# Altium project democritus-robot.PrjPcb
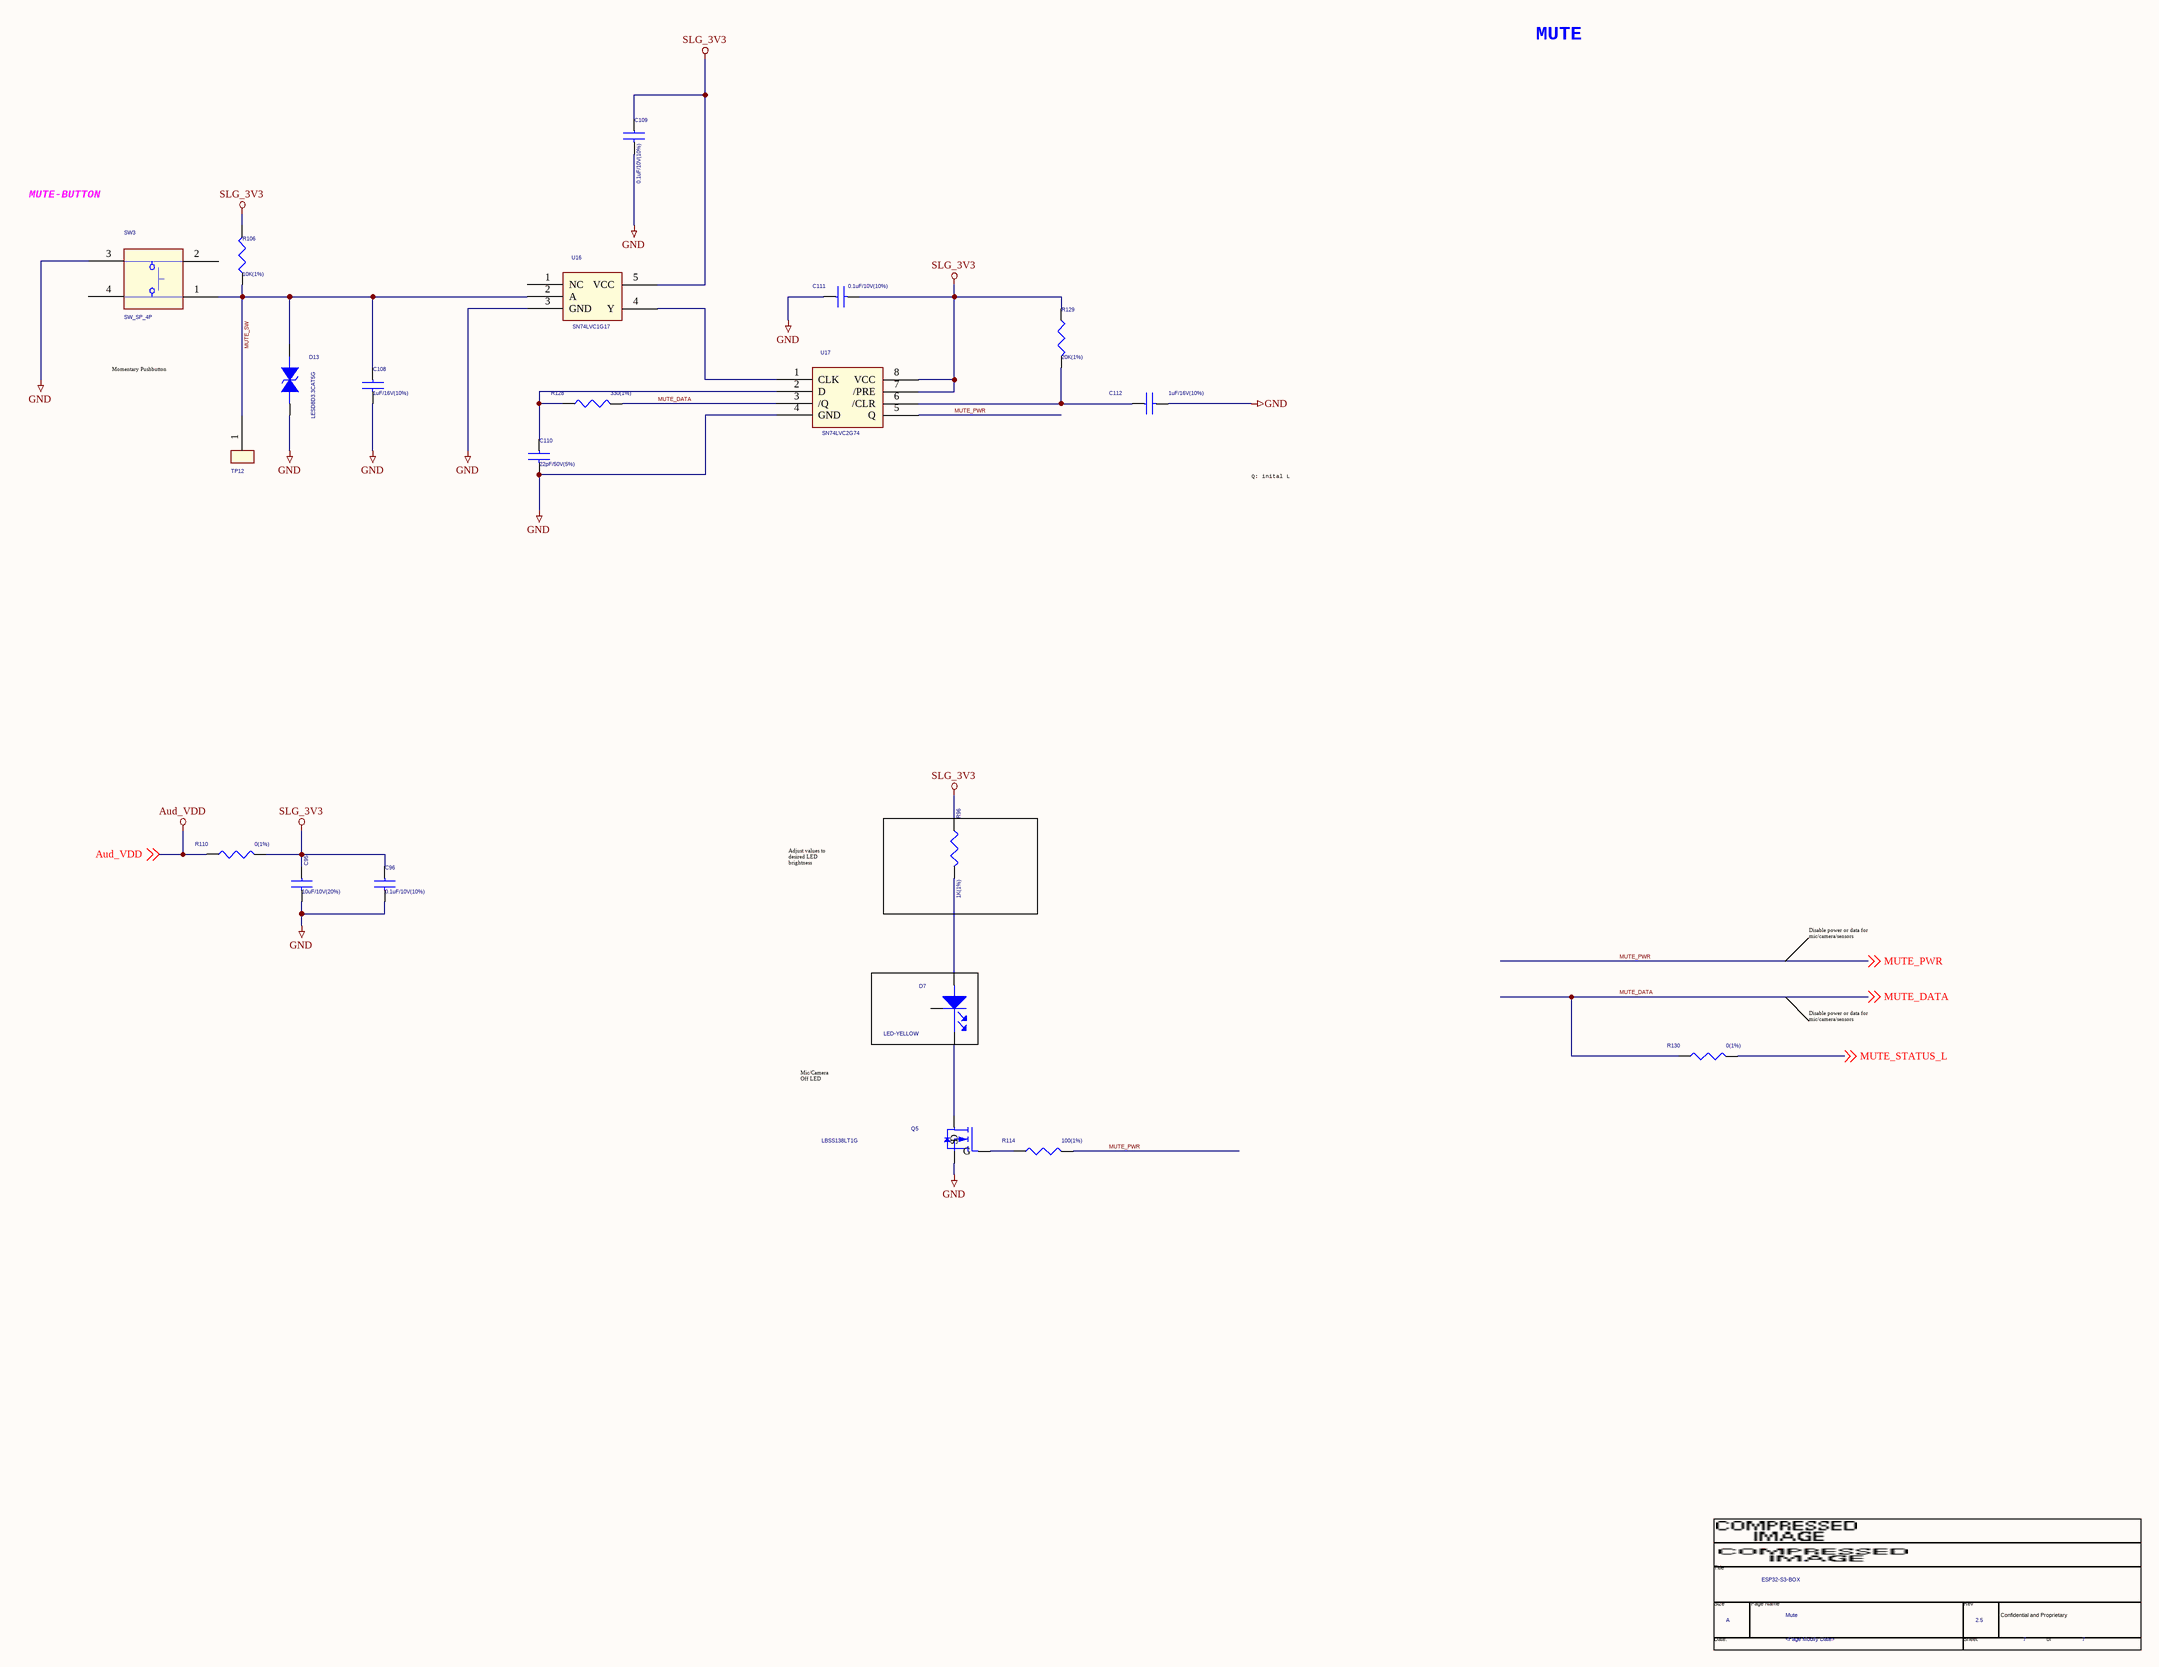
[diagram p0: 07_Mute.SchDoc]
3 sheets, 90 parts. Net scope: global (net labels, ports and power ports of the same name join across sheets).
Sheets:
  07_Mute.SchDoc
  05_Codec.SchDoc
  03_Module.SchDoc

## Sheet 07_Mute.SchDoc
size 513 x 386 mm

### Parts
(Parts that share a designator on the sheet are numbered #1, #2 ... from top to bottom, then left to right.)
*#1  Page Modify Date: <Page Modify Date>  Page Name: Mute  Title: ESP32-S3-BOX  Page Size: A  Page Number: 7  RevCode: 2.5  (hidden comment: espTitleBlock3)  (graphical)
C95  10uF/10V(20%)  [C0402]
C96  0.1uF/10V(10%)  [C0201]
C108  1uF/16V(10%)  [C0402]
C109  0.1uF/10V(10%)  [C0402]
C110  22pF/50V(5%)  [C0402]
C111  0.1uF/10V(10%)  [C0402]
C112  1uF/16V(10%)  [C0402]
D7  LED-YELLOW  [LED_SMD1206]
D13  LESD8D3.3CAT5G  [SOD882]
Q5  LBSS138LT1G  [SOT23-3]
R96  1K(1%)  [R0201]
R106  10K(1%)  [R0201]
R110  0(1%)  [R0402]
R114  100(1%)  [R0201]
R128  330(1%)  [R0402]
R129  20K(1%)  [R0402]
R130  0(1%)  [R0402]
SW3  SW_SP_4P  [SW4-3X3P5X1P1-SMT]
TP12  TESTPOINT  [TPC_D40]  (value not drawn)
U16  SN74LVC1G17  [SOT23-5-S]
U17  SN74LVC2G74  [VSSOP8]

### Nets
Aud_VDD: R110.1 ; off-sheet Aud_VDD
GND: C95.2 C96.2 C108.2 C109.2 C110.2 C111.1 C112.2 D13.1 Q5.2(S) SW3.3 U16.3(GND) U17.4(GND)
SLG_3V3: C95.1 C96.1 C109.1 C111.2 R96.2 R106.2 R110.2 R129.1 U16.5(VCC) U17.7(/PRE) U17.8(VCC)
MUTE_DATA: R128.2 R130.1 U17.3(/Q) ; off-sheet MUTE_DATA
MUTE_PWR: R114.2 U17.5(Q) ; off-sheet MUTE_PWR
MUTE_STATUS_L: R130.2 ; off-sheet MUTE_STATUS_L  [project net GPIO1]
MUTE_SW: C108.1 D13.2 R106.1 SW3.1 TP12.1 U16.2(A)
NetC110_1: C110.1 R128.1 U17.2(D)
NetC112_1: C112.1 R129.2 U17.6(/CLR)
NetD7_1: D7.1 R96.1
NetD7_2: D7.2 Q5.3(D)
NetQ5_1: Q5.1(G) R114.1
NetU16_4: U16.4(Y) U17.1(CLK)

Not connected (* = marked no-connect by the designer): D7 3; SW3 2 4; U16 1(NC)

### Notes on the sheet
- MUTE
- MUTE-BUTTON
- Momentary Pushbutton
- Q: inital L
- Adjust values to
  desired LED
  brightness
- Disable power or data for
  mic/camera/sensors
- Mic/Camera
  Off LED
- (in symbol espTitleBlock3) Title; Size; Page Name; Rev; Confidential and Proprietary; Date:; Sheet; of

### Library data of the parts
*#1 = espTitleBlock3: Doc: ESP32-S3-EYE_V1.0; OrgName: ESPRESSIF; Page Count: 7
C95 = CAPACITOR: Part Number: ES11047103700000; CODE12: ES11.04.710.3.7.0.00; Part Type: Capacitor
C96 = CAPACITOR: Part Number: ES11025103610001; CODE12: ES11.02.510.3.6.1.00; Part Type: Capacitor
C108 C112 = CAPACITOR: Part Number: ES11046104610000; CODE12: ES11.04.610.4.6.1.00; Part Type: Capacitor
C109 C111 = CAPACITOR: Part Number: ES11045103620000; CODE12: ES11.04.510.3.6.2.00; Part Type: Capacitor
C110 = CAPACITOR: Part Number: ES11041226520001; CODE12: ES11.04.122.6.5.2.00; Part Type: Capacitor
D7 = LED-BLUE
D13 = DIODE_BI_DIR: Part Number: ES31320010000000; CODE12: ES31.32.0010.00.0.0; Part Type: Diode
Q5 = NMOS: Part Number: ES31440030000000; CODE12: ES31.44.0030.00.0.0; Part Type: Transistor
R96 = RESISTOR: Part Number: ES21023100000001; CODE12: ES21.02.3100.0.00.0; Part Type: Resistor
R106 = RESISTOR: Part Number: ES21024100000001; CODE12: ES21.02.4100.0.00.0; Part Type: Resistor
R110 R130 = RESISTOR: Part Number: ES21040000000001; CODE12: ES21.04.0000.0.00.0; Part Type: Resistor
R114 = RESISTOR: Part Number: ES21022100000001; CODE12: ES21.02.2100.0.00.0; Part Type: Resistor
R128 = RESISTOR
R129 = RESISTOR: Part Number: ES21044200000001; CODE12: ES21.04.4200.0.00.0; Part Type: Resistor
SW3 = SW_SP_4P: CLASS: DISCRETE; TIME: 2004-11-29
TP12 = TESTPOINT: Part Number: ES51990010000000; CODE12: ES51.99.0010.00.00; Part Type: -

## Sheet 05_Codec.SchDoc
size 513 x 386 mm
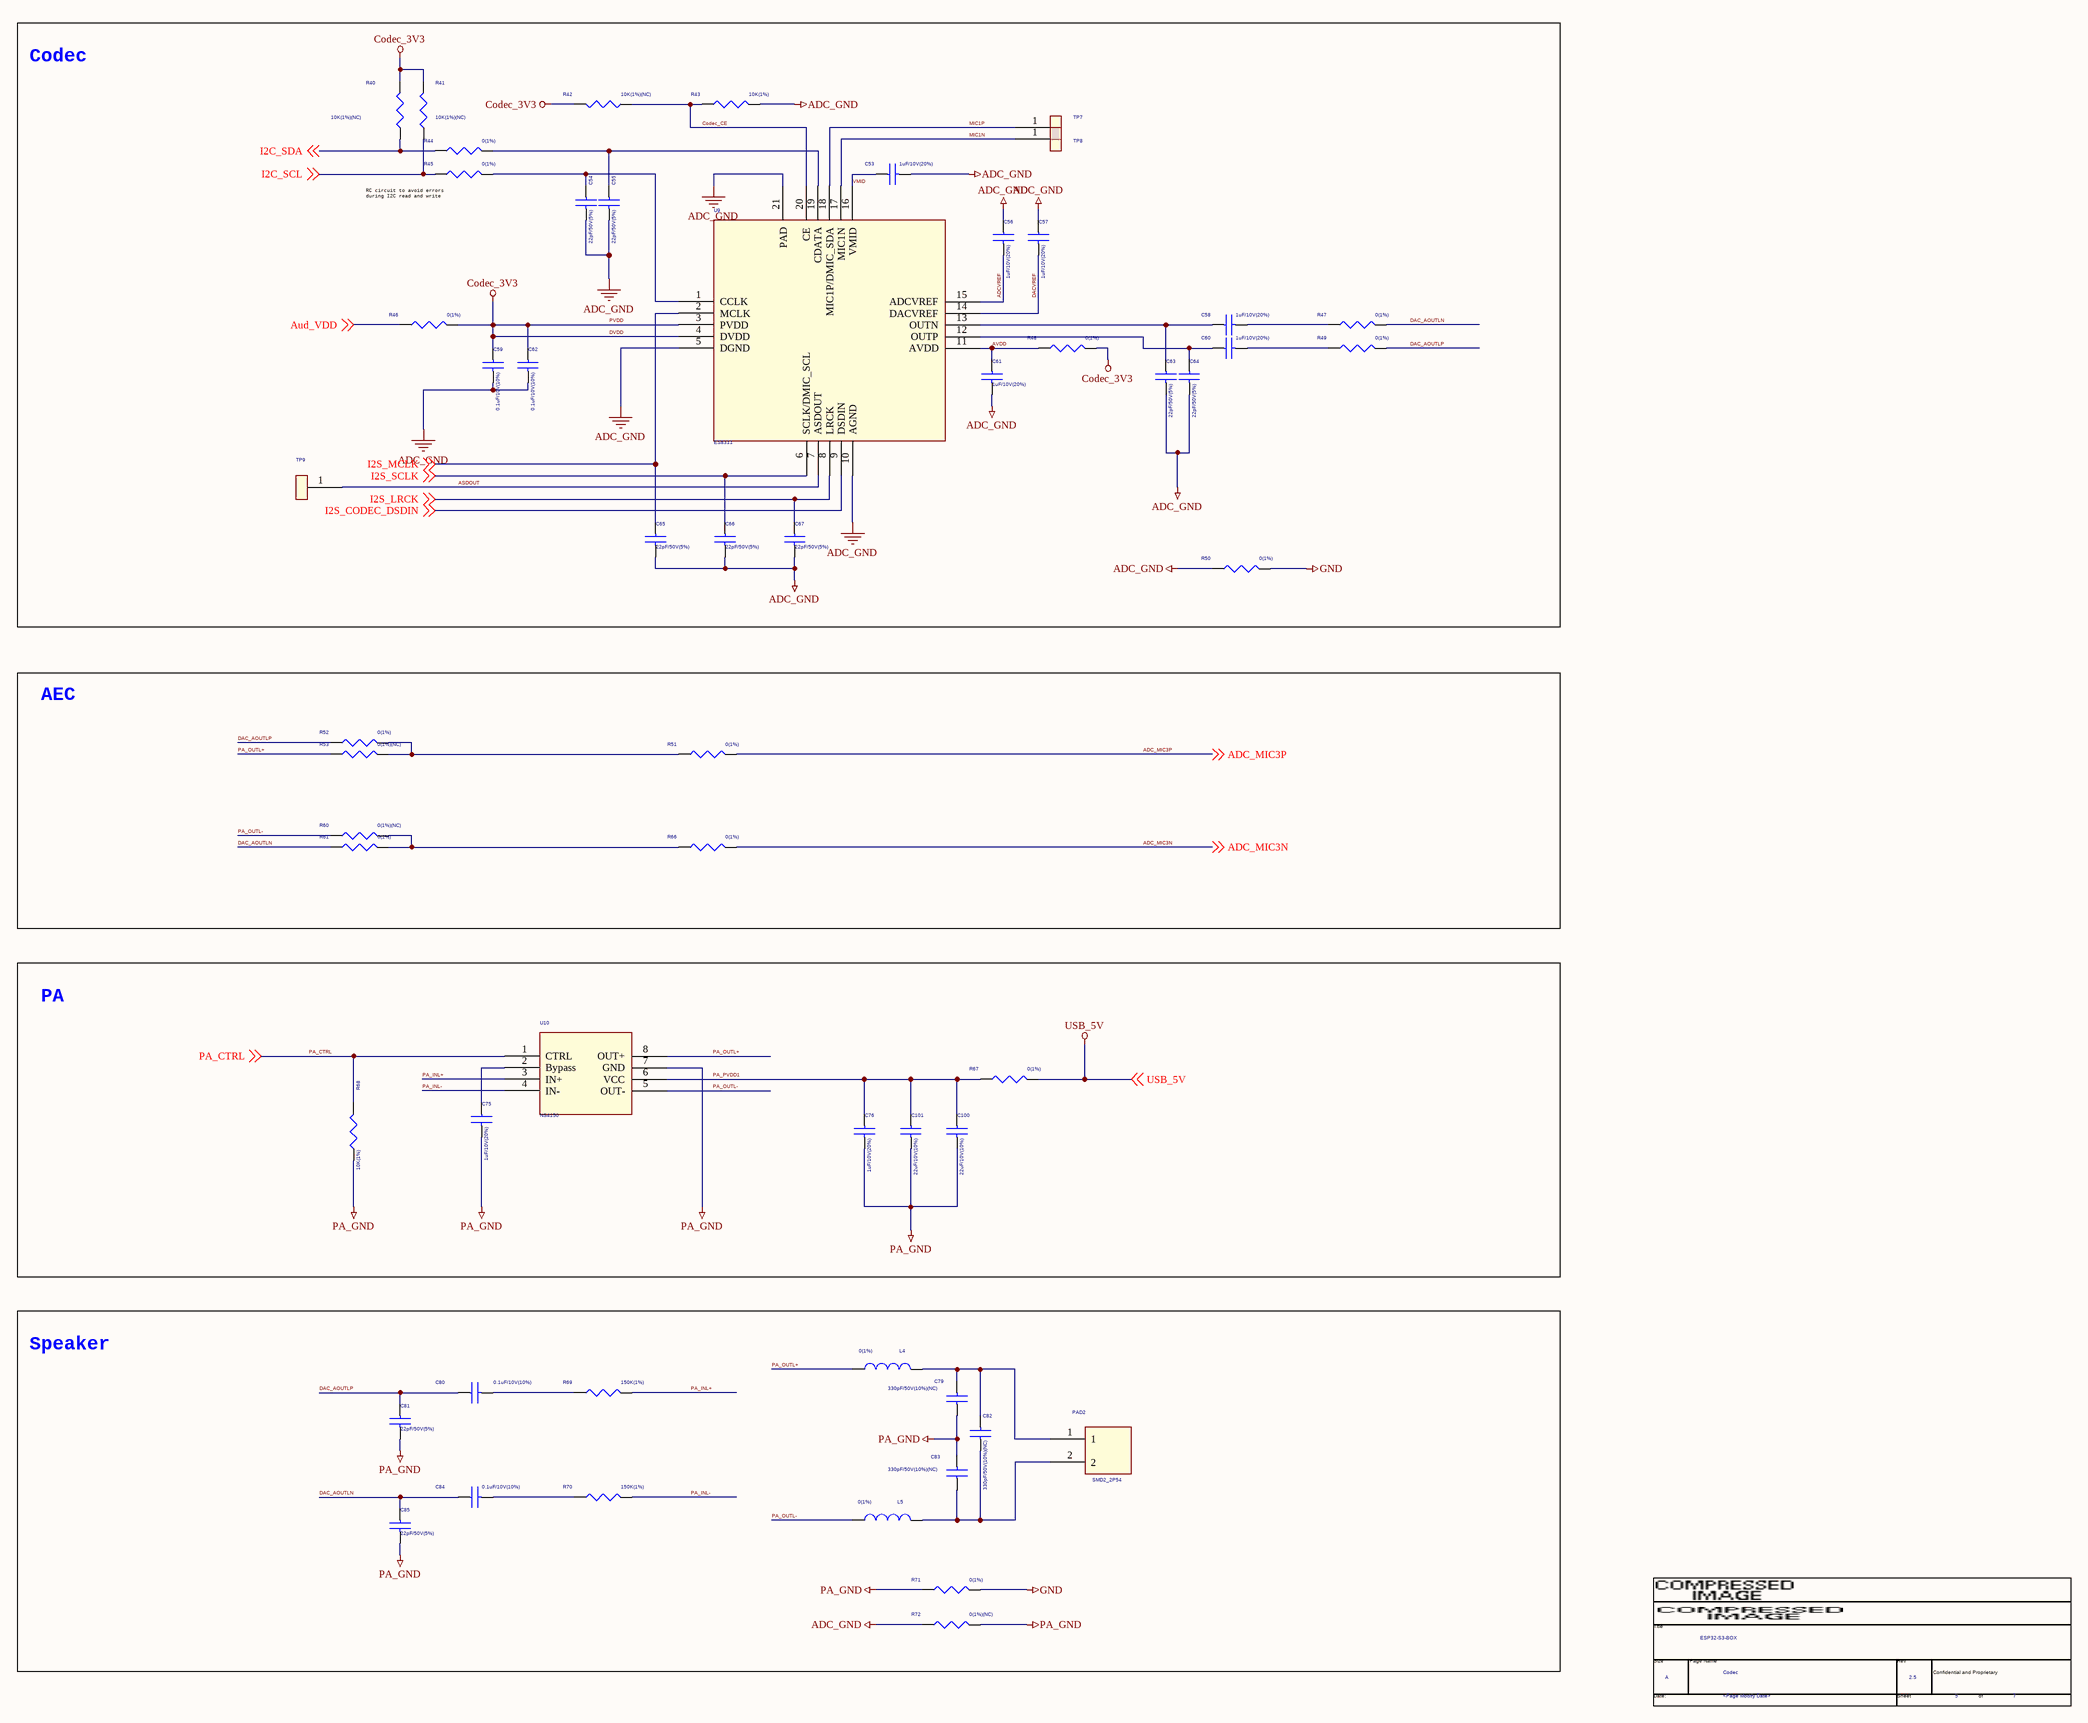
[diagram p1: 05_Codec.SchDoc]

### Parts
(Parts that share a designator on the sheet are numbered #1, #2 ... from top to bottom, then left to right.)
*#2  Page Modify Date: <Page Modify Date>  Page Name: Codec  Title: ESP32-S3-BOX  Page Size: A  Page Number: 5  Page Count: 7  RevCode: 2.5  (hidden comment: espTitleBlock3)  (graphical)
C53  1uF/10V(20%)  [C0201]
C54  22pF/50V(5%)  [C0201]
C55  22pF/50V(5%)  [C0201]
C56  1uF/10V(20%)  [C0201]
C57  1uF/10V(20%)  [C0201]
C58  1uF/10V(20%)  [C0201]
C59  0.1uF/10V(10%)  [C0201]
C60  1uF/10V(20%)  [C0201]
C61  1uF/10V(20%)  [C0201]
C62  0.1uF/10V(10%)  [C0201]
C63  22pF/50V(5%)  [C0201]
C64  22pF/50V(5%)  [C0201]
C65  22pF/50V(5%)  [C0201]
C66  22pF/50V(5%)  [C0201]
C67  22pF/50V(5%)  [C0201]
C75  1uF/10V(20%)  [C0201]
C76  1uF/10V(20%)  [C0201]
C79  330pF/50V(10%)(NC)  [C0201]
C80  0.1uF/10V(10%)  [C0201]
C81  22pF/50V(5%)  [C0201]
C82  330pF/50V(10%)(NC)  [C0201]
C83  330pF/50V(10%)(NC)  [C0201]
C84  0.1uF/10V(10%)  [C0201]
C85  22pF/50V(5%)  [C0201]
C100  22uF/10V(10%)  [C0805]
C101  22uF/10V(10%)  [C0805]
L4  0(1%)  [R0603]
L5  0(1%)  [R0603]
PAD2  SMD2_2P54  [SMD2_2P54]
R40  10K(1%)(NC)  [R0201]
R41  10K(1%)(NC)  [R0201]
R42  10K(1%)(NC)  [R0201]
R43  10K(1%)  [R0201]
R44  0(1%)  [R0201]
R45  0(1%)  [R0201]
R46  0(1%)  [R0402]
R47  0(1%)  [R0201]
R48  0(1%)  [R0402]
R49  0(1%)  [R0201]
R50  0(1%)  [R0402]
R51  0(1%)  [R0201]
R52  0(1%)  [R0201]
R53  0(1%)(NC)  [R0201]
R60  0(1%)(NC)  [R0201]
R61  0(1%)  [R0201]
R66  0(1%)  [R0201]
R67  0(1%)  [R0402]
R68  10K(1%)  [R0201]
R69  150K(1%)  [R0402]
R70  150K(1%)  [R0402]
R71  0(1%)  [R0402]
R72  0(1%)(NC)  [R0402]
TP7  TESTPOINT  [TPC_D40]  (value not drawn)
TP8  TESTPOINT  [TPC_D40]  (value not drawn)
TP9  TESTPOINT  [TPC_D40]  (value not drawn)
U9  ES8311  [QFN20_0P4_3]
U10  NS4150  [SSOP8_0P65_5]

### Blocks framed on the sheet
Codec: C53-C67 R40-R50 TP7-TP9 U9
AEC: R51-R53 R60 R61 R66
PA: C75 C76 C100 C101 R67 R68 U10
Speaker: C79-C85 L4 L5 PAD2 R69-R72

### Nets
ADC_GND: C53.2 C54.2 C55.2 C56.1 C57.1 C59.2 C61.2 C62.2 C63.2 C64.2 C65.2 C66.2 C67.2 R43.2 R50.1 R72.1 U9.5(DGND) U9.10(AGND) U9.21(PAD)
Aud_VDD: R46.1 ; off-sheet Aud_VDD
DVDD: C59.1 C62.1 R40.2 R41.2 R42.2 R46.2 R48.2 U9.3(PVDD) U9.4(DVDD)  [also labelled Codec_3V3, PVDD]
GND: R50.2 R71.2
PA_GND: C75.2 C76.2 C79.1 C81.2 C83.2 C85.2 C100.2 C101.2 R68.1 R71.1 R72.2 U10.7(GND)
USB_5V: R67.2 ; off-sheet USB_5V
ADC_MIC3N: R66.2 ; off-sheet ADC_MIC3N
ADC_MIC3P: R51.2 ; off-sheet ADC_MIC3P
ADCVREF: C56.2 U9.15(ADCVREF)
ASDOUT: TP9.1 U9.7(ASDOUT)
AVDD: C61.1 R48.1 U9.11(AVDD)
Codec_CE: R42.1 R43.1 U9.20(CE)
DAC_AOUTLN: C84.1 C85.1 R47.2 R61.1
DAC_AOUTLP: C80.1 C81.1 R49.2 R52.1
DACVREF: C57.2 U9.14(DACVREF)
I2C_SCL: R41.1 R45.1 ; off-sheet I2C_SCL  [project net GPIO18]
I2C_SDA: R40.1 R44.1 ; off-sheet I2C_SDA  [project net GPIO8]
I2S_CODEC_DSDIN: U9.9(DSDIN) ; off-sheet I2S_CODEC_DSDIN  [project net GPIO15]
I2S_LRCK: C67.1 U9.8(LRCK) ; off-sheet I2S_LRCK  [project net GPIO47]
I2S_MCLK: C65.1 U9.2(MCLK) ; off-sheet I2S_MCLK  [project net GPIO2]
I2S_SCLK: C66.1 U9.6(SCLK/DMIC_SCL) ; off-sheet I2S_SCLK  [project net GPIO17]
MIC1N: TP8.1 U9.17(MIC1N)
MIC1P: TP7.1 U9.18(MIC1P/DMIC_SDA)
PA_CTRL: R68.2 U10.1(CTRL) ; off-sheet PA_CTRL  [project net GPIO46]
PA_INL+: R69.2 U10.3(IN+)
PA_INL-: R70.2 U10.4(IN-)
PA_OUTL+: L4.2 R53.1 U10.8(OUT+)
PA_OUTL-: L5.2 R60.1 U10.5(OUT-)
PA_PVDD1: C76.1 C100.1 C101.1 R67.1 U10.6(VCC)
VMID: C53.1 U9.16(VMID)
NetC54_1: C54.1 R45.2 U9.1(CCLK)
NetC55_1: C55.1 R44.2 U9.19(CDATA)
NetC58_1: C58.1 C63.1 U9.13(OUTN)
NetC58_2: C58.2 R47.1
NetC60_1: C60.1 C64.1 U9.12(OUTP)
NetC60_2: C60.2 R49.1
NetC75_1: C75.1 U10.2(Bypass)
NetC79_2: C79.2 C82.2 L4.1 PAD2.1
NetC80_2: C80.2 R69.1
NetC82_1: C82.1 C83.1 L5.1 PAD2.2
NetC84_2: C84.2 R70.1
NetR51_1: R51.1 R52.2 R53.2
NetR60_2: R60.2 R61.2 R66.1

### Notes on the sheet
- (near R45) RC circuit to avoid errors
  during I2C read and write
- (in symbol espTitleBlock3) Title; Size; Page Name; Rev; Confidential and Proprietary; Date:; Sheet; of

### Library data of the parts
*#2 = espTitleBlock3: as *#1 on sheet 07_Mute
C53 C56-C58 C60 C61 C75 C76 = CAPACITOR: Part Number: ES11026103700001; CODE12: ES11.02.610.3.7.0.00; Part Type: Capacitor
C54 C55 C63-C67 C81 C85 = CAPACITOR: Part Number: ES11021226520000; CODE12: ES11.02.122.6.5.2.00; Part Type: Capacitor
C59 C62 C80 C84 = CAPACITOR: as C96 on sheet 07_Mute; Part Type: Capacitor
C79 C82 C83 = CAP NP
C100 C101 = CAPACITOR: Part Number: ES11087223720000; CODE12: ES11.08.722.3.7.2.00; Part Type: Capacitor
L4 L5 = INDUCTOR
R40-R43 R68 = RESISTOR: as R106 on sheet 07_Mute; Part Type: Resistor
R44 R45 R47 R49 R51-R53 R60 R61 R66 = RESISTOR: Part Number: ES21020000000001; CODE12: ES21.02.0000.0.00.0; Part Type: Resistor
R46 R48 R50 R67 R71 R72 = RESISTOR: as R110 on sheet 07_Mute; Part Type: Resistor
R69 R70 = RESISTOR: Part Number: ES21045150000001; CODE12: ES21.04.5150.0.00.0; Part Type: Resistor
TP7-TP9 = TESTPOINT: as TP12 on sheet 07_Mute; Part Type: -
U9 = ES8311: Part Number: ES41181204000000; CODE12: ES41.18.12.04.00.00; Part Type: Audio ICs
U10 = NS4150: Part Number: ES41180401000000; CODE12: ES41.18.04.01.00.00; Part Type: Audio ICs

## Sheet 03_Module.SchDoc
size 297 x 209 mm
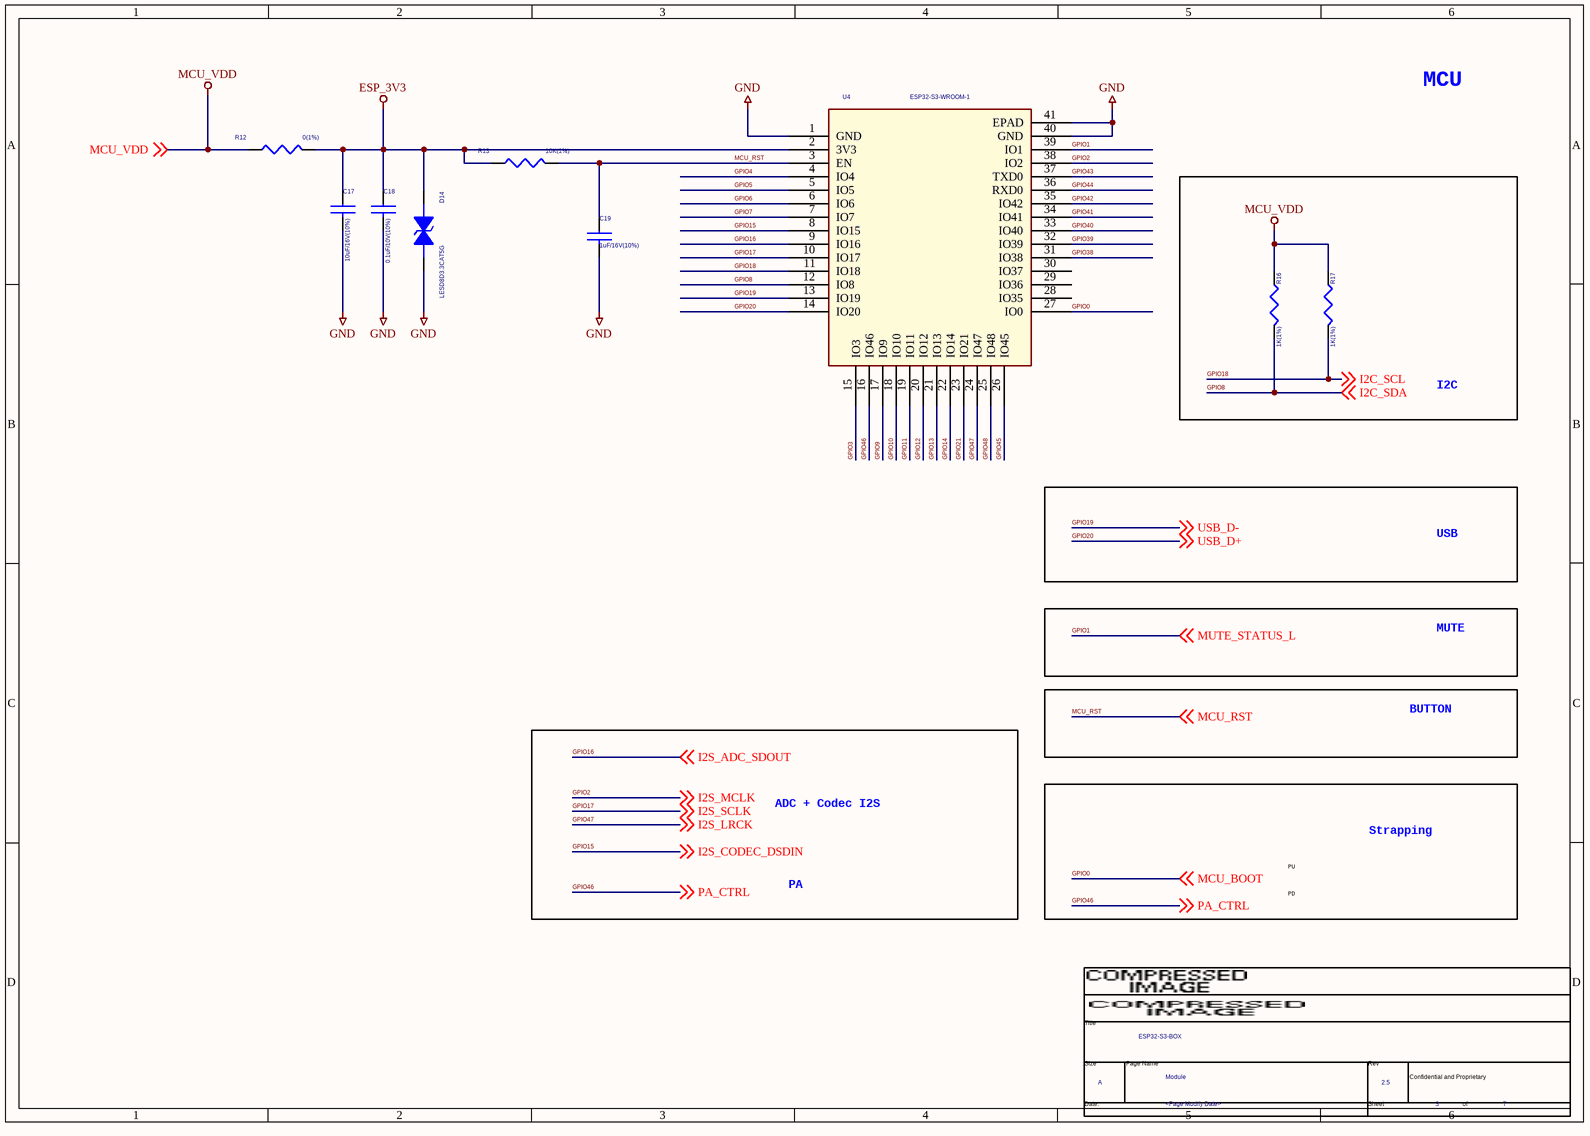
[diagram p2: 03_Module.SchDoc]

### Parts
(Parts that share a designator on the sheet are numbered #1, #2 ... from top to bottom, then left to right.)
*#3  Page Modify Date: <Page Modify Date>  Page Name: Module  Title: ESP32-S3-BOX  Page Size: A  Page Number: 3  Page Count: 7  RevCode: 2.5  (hidden comment: espTitleBlock3)  (graphical)
C17  10uF/16V(10%)  [C0603]
C18  0.1uF/10V(10%)  [C0402]
C19  1uF/16V(10%)  [C0402]
D14  LESD8D3.3CAT5G  [SOD882]
R12  0(1%)  [R0603]
R13  10K(1%)  [R0402]
R16  1K(1%)  [R0201]
R17  1K(1%)  [R0201]
U4  ESP32-S3-WROOM-1  [ESP32-S3-WROOM]

### Blocks framed on the sheet
I2C: R16 R17

### Nets
ESP_3V3: C17.1 C18.1 D14.2 R12.2 R13.1 U4.2(3V3)
GND: C17.2 C18.2 C19.2 D14.1 U4.1(GND) U4.40(GND) U4.41(EPAD)
MCU_VDD: R12.1 R16.1 R17.1 ; off-sheet MCU_VDD
GPIO0: U4.27(IO0) ; off-sheet MCU_BOOT  [also labelled MCU_BOOT]
GPIO1: U4.39(IO1) ; off-sheet MUTE_STATUS_L  [also labelled MUTE_STATUS_L]
GPIO2: U4.38(IO2) ; off-sheet I2S_MCLK  [also labelled I2S_MCLK]
GPIO3: U4.15(IO3)
GPIO4: U4.4(IO4)
GPIO5: U4.5(IO5)
GPIO6: U4.6(IO6)
GPIO7: U4.7(IO7)
GPIO8: R16.2 U4.12(IO8) ; off-sheet I2C_SDA  [also labelled I2C_SDA]
GPIO9: U4.17(IO9)
GPIO10: U4.18(IO10)
GPIO11: U4.19(IO11)
GPIO12: U4.20(IO12)
GPIO13: U4.21(IO13)
GPIO14: U4.22(IO14)
GPIO15: U4.8(IO15) ; off-sheet I2S_CODEC_DSDIN  [also labelled I2S_CODEC_DSDIN]
GPIO16: U4.9(IO16) ; off-sheet I2S_ADC_SDOUT  [also labelled I2S_ADC_SDOUT]
GPIO17: U4.10(IO17) ; off-sheet I2S_SCLK  [also labelled I2S_SCLK]
GPIO18: R17.2 U4.11(IO18) ; off-sheet I2C_SCL  [also labelled I2C_SCL]
GPIO19: U4.13(IO19) ; off-sheet USB_D-  [also labelled USB_D-]
GPIO20: U4.14(IO20) ; off-sheet USB_D+  [also labelled USB_D+]
GPIO21: U4.23(IO21)
GPIO38: U4.31(IO38)
GPIO39: U4.32(IO39)
GPIO40: U4.33(IO40)
GPIO41: U4.34(IO41)
GPIO42: U4.35(IO42)
GPIO43: U4.37(TXD0)
GPIO44: U4.36(RXD0)
GPIO45: U4.26(IO45)
GPIO46: U4.16(IO46) ; off-sheet PA_CTRL  [also labelled PA_CTRL]
GPIO47: U4.24(IO47) ; off-sheet I2S_LRCK  [also labelled I2S_LRCK]
GPIO48: U4.25(IO48)
MCU_RST: C19.1 R13.2 U4.3(EN) ; off-sheet MCU_RST

Not connected (* = marked no-connect by the designer): U4 28(IO35) 29(IO36) 30(IO37)

### Notes on the sheet
- MCU
- USB
- MUTE
- BUTTON
- ADC + Codec I2S
- PU
- Strapping
- PA
- PD
- (in symbol espTitleBlock3) Title; Size; Page Name; Rev; Confidential and Proprietary; Date:; Sheet; of

### Library data of the parts
*#3 = espTitleBlock3: as *#1 on sheet 07_Mute
C17 = CAPACITOR: Part Number: ES11067104600000; CODE12: ES11.06.710.4.6.0.00; Part Type: Capacitor
C18 = CAPACITOR: as C109 on sheet 07_Mute; Part Type: Capacitor
C19 = CAPACITOR: as C108 on sheet 07_Mute; Part Type: Capacitor
D14 = DIODE_BI_DIR: as D13 on sheet 07_Mute; Part Type: Diode
R12 = RESISTOR: Part Number: ES21060000000001; CODE12: ES21.06.0000.0.00.0; Part Type: Resistor
R13 = RESISTOR: Part Number: ES21044100000001; CODE12: ES21.04.4100.0.00.0; Part Type: Resistor
R16 R17 = RESISTOR: as R96 on sheet 07_Mute; Part Type: Resistor
U4 = ESP32-S3-WROOM

## Nets that join several sheets
Aud_VDD: 07_Mute (R110.1), 05_Codec (R46.1)
GND: 07_Mute (12 pins), 05_Codec (R50.2 R71.2), 03_Module (7 pins)
GPIO1: 07_Mute (R130.2), 03_Module (U4.39)
GPIO2: 05_Codec (C65.1 U9.2), 03_Module (U4.38)
GPIO8: 05_Codec (R40.1 R44.1), 03_Module (R16.2 U4.12)
GPIO15: 05_Codec (U9.9), 03_Module (U4.8)
GPIO17: 05_Codec (C66.1 U9.6), 03_Module (U4.10)
GPIO18: 05_Codec (R41.1 R45.1), 03_Module (R17.2 U4.11)
GPIO46: 05_Codec (R68.2 U10.1), 03_Module (U4.16)
GPIO47: 05_Codec (C67.1 U9.8), 03_Module (U4.24)